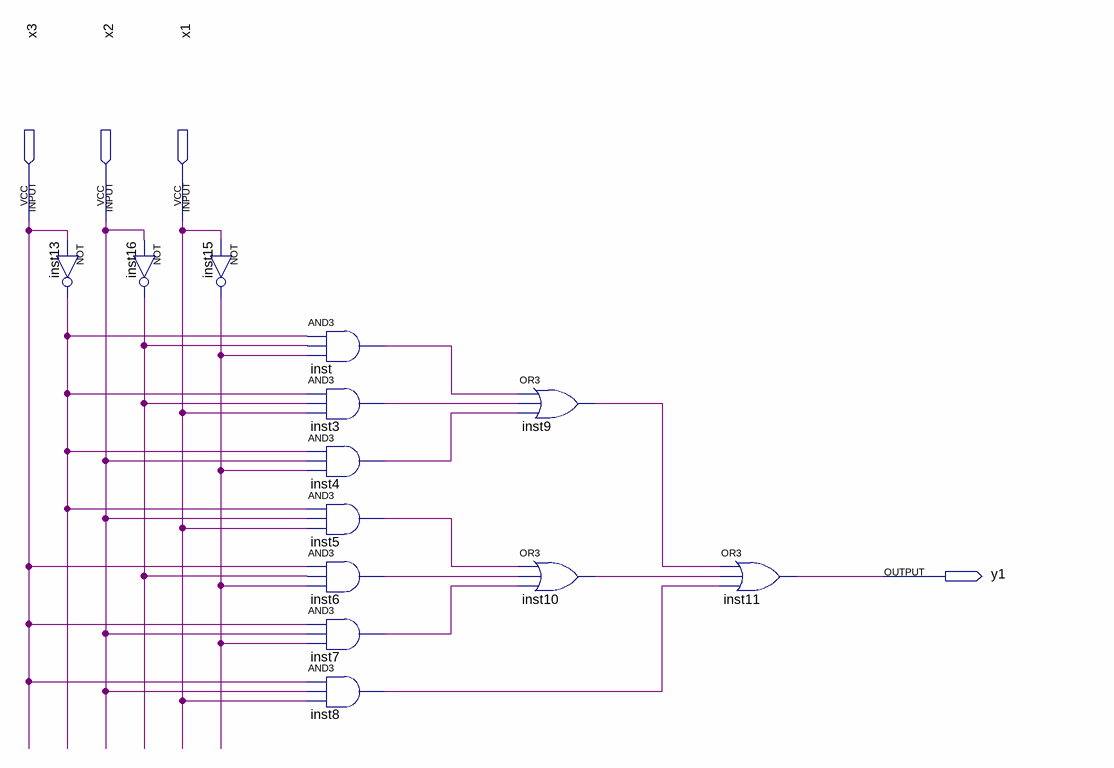
[diagram p0: schematic sheet]
// Quartus schematic L0102.bdf as structural Verilog: 13 symbols, 4 pins
module L0102 (
  input  x3,
  input  x2,
  input  x1,
  output y1
);

  wire inst3_out, inst4_out, inst5_out, inst6_out, inst7_out, inst8_out, inst9_out, inst10_out, inst13_out,
       inst15_out, inst16_out, inst_out;

  not inst13 (inst13_out, x3);
  not inst16 (inst16_out, x2);
  not inst15 (inst15_out, x1);
  and inst (inst_out, inst13_out, inst16_out, inst15_out);
  and inst3 (inst3_out, inst13_out, inst16_out, x1);
  and inst4 (inst4_out, inst13_out, x2, inst15_out);
  and inst5 (inst5_out, inst13_out, x2, x1);
  and inst6 (inst6_out, x3, inst16_out, inst15_out);
  and inst7 (inst7_out, x3, x2, inst15_out);
  and inst8 (inst8_out, x3, x2, x1);
  or inst9 (inst9_out, inst_out, inst3_out, inst4_out);
  or inst10 (inst10_out, inst5_out, inst6_out, inst7_out);
  or inst11 (y1, inst9_out, inst10_out, inst8_out);
endmodule
